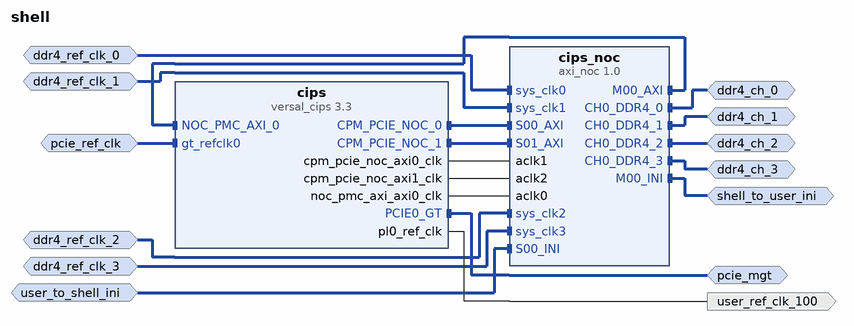
[diagram p0: block diagram of the top level]
# Vivado block design shell, xcvc1902-vsvd1760-2MP-e-S, Vivado 2022.2
create_bd_design shell

create_bd_intf_port -mode Slave -vlnv xilinx.com:interface:diff_clock_rtl:1.0 pcie_ref_clk
create_bd_intf_port -mode Master -vlnv xilinx.com:interface:gt_rtl:1.0 pcie_mgt
create_bd_intf_port -mode Slave -vlnv xilinx.com:interface:diff_clock_rtl:1.0 ddr4_ref_clk_0
set_property -dict {CONFIG.FREQ_HZ 200000000} [get_bd_intf_ports ddr4_ref_clk_0]
create_bd_intf_port -mode Slave -vlnv xilinx.com:interface:diff_clock_rtl:1.0 ddr4_ref_clk_1
set_property -dict {CONFIG.FREQ_HZ 200000000} [get_bd_intf_ports ddr4_ref_clk_1]
create_bd_intf_port -mode Slave -vlnv xilinx.com:interface:diff_clock_rtl:1.0 ddr4_ref_clk_2
set_property -dict {CONFIG.FREQ_HZ 200000000} [get_bd_intf_ports ddr4_ref_clk_2]
create_bd_intf_port -mode Slave -vlnv xilinx.com:interface:diff_clock_rtl:1.0 ddr4_ref_clk_3
set_property -dict {CONFIG.FREQ_HZ 200000000} [get_bd_intf_ports ddr4_ref_clk_3]
create_bd_intf_port -mode Master -vlnv xilinx.com:interface:ddr4_rtl:1.0 ddr4_ch_0
create_bd_intf_port -mode Master -vlnv xilinx.com:interface:ddr4_rtl:1.0 ddr4_ch_1
create_bd_intf_port -mode Master -vlnv xilinx.com:interface:ddr4_rtl:1.0 ddr4_ch_2
create_bd_intf_port -mode Master -vlnv xilinx.com:interface:ddr4_rtl:1.0 ddr4_ch_3
create_bd_intf_port -mode Master -vlnv xilinx.com:interface:inimm_rtl:1.0 shell_to_user_ini
set_property -dict {CONFIG.INI_STRATEGY auto} [get_bd_intf_ports shell_to_user_ini]
create_bd_intf_port -mode Slave -vlnv xilinx.com:interface:inimm_rtl:1.0 user_to_shell_ini
create_bd_port -dir O -type clk user_ref_clk_100

create_bd_cell -type ip -vlnv xilinx.com:ip:versal_cips:3.3 cips
set_property -dict [list \
  CONFIG.BOOT_MODE Custom \
  CONFIG.CLOCK_MODE Custom \
  CONFIG.CPM_CONFIG {['CPM_PCIE0_CFG_EXT_IF 0 CPM_PCIE0_COPY_XDMA_PF0_ENABLED 0 CPM_PCIE0_EXT_PCIE_CFG_SPACE_ENABLED None CPM_PCIE0_MAX_LINK_SPEED 16.0_GT/s CPM_PCIE0_MODES DMA CPM_PCIE0_MODE_SELECTION Advanced', 'CPM_PCIE0_MSI_X_OPTIONS MSI-X_Internal CPM_PCIE0_NUM_USR_IRQ 16 CPM_PCIE0_PF0_BAR0_XDMA_64BIT 1 CPM_PCIE0_PF0_BAR0_XDMA_TYPE DMA CPM_PCIE0_PF0_BAR2_XDMA_64BIT 1 CPM_PCIE0_PF0_BAR2_XDMA_ENABLED 1', 'CPM_PCIE0_PF0_BAR2_XDMA_SCALE Megabytes CPM_PCIE0_PF0_BAR2_XDMA_SIZE 128 CPM_PCIE0_PF0_BASE_CLASS_MENU Processors CPM_PCIE0_PF0_INTERRUPT_PIN INTA CPM_PCIE0_PF0_PCIEBAR2AXIBAR_XDMA_2 0x00101220000', 'CPM_PCIE0_PF0_SUB_CLASS_INTF_MENU Co_processor CPM_PCIE0_PF0_USE_CLASS_CODE_LOOKUP_ASSISTANT 1 CPM_PCIE0_PF1_BAR0_XDMA_64BIT 0 CPM_PCIE0_PF1_BAR0_XDMA_SCALE Kilobytes CPM_PCIE0_PF1_BAR0_XDMA_SIZE 4', 'CPM_PCIE0_PF1_BAR0_XDMA_TYPE AXI_Bridge_Master CPM_PCIE0_PF1_BAR2_XDMA_64BIT 1 CPM_PCIE0_PF1_BAR2_XDMA_ENABLED 1 CPM_PCIE0_PF1_BAR2_XDMA_SCALE Megabytes CPM_PCIE0_PF1_BAR2_XDMA_SIZE 128', 'CPM_PCIE0_PF1_BAR2_XDMA_TYPE AXI_Bridge_Master CPM_PCIE0_PF1_BASE_CLASS_MENU Processors CPM_PCIE0_PF1_INTERRUPT_PIN INTB CPM_PCIE0_PF1_PCIEBAR2AXIBAR_XDMA_2 0x20100000000', 'CPM_PCIE0_PF1_SUB_CLASS_INTF_MENU Co_processor CPM_PCIE0_PF1_USE_CLASS_CODE_LOOKUP_ASSISTANT 1 CPM_PCIE0_PL_LINK_CAP_MAX_LINK_WIDTH X8 CPM_PCIE0_TL_PF_ENABLE_REG 1 CPM_PCIE0_XDMA_RNUM_CHNL 4', 'CPM_PCIE0_XDMA_WNUM_CHNL 4 CPM_PCIE1_MODES None PS_USE_NOC_PS_PCI_0 0']} \
  CONFIG.DDR_MEMORY_MODE Custom \
  CONFIG.DESIGN_MODE 1 \
  CONFIG.DEVICE_INTEGRITY_MODE Custom \
  CONFIG.IO_CONFIG_MODE Custom \
  CONFIG.PS_PMC_CONFIG {['CLOCK_MODE Custom', 'DESIGN_MODE 1', 'DEVICE_INTEGRITY_MODE Custom', 'IO_CONFIG_MODE Custom', 'PCIE_APERTURES_DUAL_ENABLE 0', 'PCIE_APERTURES_SINGLE_ENABLE 1', 'PMC_BANK_1_IO_STANDARD LVCMOS3.3', 'PMC_CRP_HSM0_REF_CTRL_FREQMHZ 33.33333333', 'PMC_CRP_HSM1_REF_CTRL_FREQMHZ 133.3333333', 'PMC_CRP_OSPI_REF_CTRL_FREQMHZ 101', 'PMC_CRP_PL0_REF_CTRL_FREQMHZ 100', 'PMC_I2CPMC_PERIPHERAL {{ENABLE 1} {IO {PMC_MIO 26 .. 27}}}', 'PMC_MIO12 {{AUX_IO 0} {DIRECTION out} {DRIVE_STRENGTH 8mA} {OUTPUT_DATA default} {PULL pullup} {SCHMITT 0} {SLEW slow} {USAGE GPIO}}', 'PMC_MIO39 {{AUX_IO 0} {DIRECTION in} {DRIVE_STRENGTH 4mA} {OUTPUT_DATA default} {PULL disable} {SCHMITT 0} {SLEW slow} {USAGE GPIO}}', 'PMC_MIO40 {{AUX_IO 0} {DIRECTION out} {DRIVE_STRENGTH 8mA} {OUTPUT_DATA default} {PULL pullup} {SCHMITT 0} {SLEW slow} {USAGE GPIO}}', 'PMC_MIO41 {{AUX_IO 0} {DIRECTION in} {DRIVE_STRENGTH 8mA} {OUTPUT_DATA default} {PULL pullup} {SCHMITT 0} {SLEW slow} {USAGE GPIO}}', 'PMC_MIO42 {{AUX_IO 0} {DIRECTION in} {DRIVE_STRENGTH 8mA} {OUTPUT_DATA default} {PULL pullup} {SCHMITT 0} {SLEW slow} {USAGE GPIO}}', 'PMC_MIO43 {{AUX_IO 0} {DIRECTION out} {DRIVE_STRENGTH 8mA} {OUTPUT_DATA default} {PULL pullup} {SCHMITT 0} {SLEW slow} {USAGE GPIO}}', 'PMC_MIO44 {{AUX_IO 0} {DIRECTION out} {DRIVE_STRENGTH 8mA} {OUTPUT_DATA default} {PULL pullup} {SCHMITT 0} {SLEW slow} {USAGE GPIO}}', 'PMC_MIO45 {{AUX_IO 0} {DIRECTION out} {DRIVE_STRENGTH 8mA} {OUTPUT_DATA default} {PULL pullup} {SCHMITT 0} {SLEW slow} {USAGE GPIO}}', 'PMC_MIO46 {{AUX_IO 0} {DIRECTION in} {DRIVE_STRENGTH 8mA} {OUTPUT_DATA default} {PULL pullup} {SCHMITT 0} {SLEW slow} {USAGE GPIO}}', 'PMC_MIO47 {{AUX_IO 0} {DIRECTION in} {DRIVE_STRENGTH 8mA} {OUTPUT_DATA default} {PULL pullup} {SCHMITT 0} {SLEW slow} {USAGE GPIO}}', 'PMC_MIO48 {{AUX_IO 0} {DIRECTION out} {DRIVE_STRENGTH 8mA} {OUTPUT_DATA default} {PULL pullup} {SCHMITT 0} {SLEW slow} {USAGE GPIO}}', 'PMC_MIO49 {{AUX_IO 0} {DIRECTION out} {DRIVE_STRENGTH 8mA} {OUTPUT_DATA default} {PULL pullup} {SCHMITT 0} {SLEW slow} {USAGE GPIO}}', 'PMC_MIO50 {{AUX_IO 0} {DIRECTION out} {DRIVE_STRENGTH 8mA} {OUTPUT_DATA default} {PULL pullup} {SCHMITT 0} {SLEW slow} {USAGE GPIO}}', 'PMC_OSPI_PERIPHERAL {{ENABLE 1} {IO {PMC_MIO 0 .. 11}} {MODE Single}}', 'PMC_REF_CLK_FREQMHZ 33.3333333', 'PMC_USE_NOC_PMC_AXI0 1', 'PS_BANK_2_IO_STANDARD LVCMOS3.3', 'PS_BOARD_INTERFACE Custom', 'PS_GEN_IPI0_ENABLE 1', 'PS_GEN_IPI1_ENABLE 1', 'PS_GEN_IPI2_ENABLE 1', 'PS_GEN_IPI3_ENABLE 1', 'PS_GEN_IPI3_MASTER R5_0', 'PS_GEN_IPI4_ENABLE 1', 'PS_GEN_IPI4_MASTER R5_0', 'PS_GEN_IPI5_ENABLE 1', 'PS_GEN_IPI5_MASTER R5_1', 'PS_GEN_IPI6_ENABLE 1', 'PS_GEN_IPI6_MASTER R5_1', 'PS_I2C0_PERIPHERAL {{ENABLE 1} {IO {PMC_MIO 30 .. 31}}}', 'PS_I2C1_PERIPHERAL {{ENABLE 1} {IO {PS_MIO 24 .. 25}}}', 'PS_I2CSYSMON_PERIPHERAL {{ENABLE 0} {IO {PMC_MIO 18 .. 20}}}', 'PS_IRQ_USAGE {{CH0 0} {CH1 0} {CH10 0} {CH11 0} {CH12 0} {CH13 0} {CH14 0} {CH15 0} {CH2 0} {CH3 0} {CH4 0} {CH5 0} {CH6 0} {CH7 0} {CH8 0} {CH9 0}}', 'PS_MIO5 {{AUX_IO 0} {DIRECTION out} {DRIVE_STRENGTH 8mA} {OUTPUT_DATA high} {PULL pulldown} {SCHMITT 0} {SLEW slow} {USAGE GPIO}}', 'PS_NUM_FABRIC_RESETS 0', 'PS_PCIE1_PERIPHERAL_ENABLE 1', 'PS_PCIE2_PERIPHERAL_ENABLE 0', 'PS_PCIE_EP_RESET1_IO {PMC_MIO 38}', 'PS_PCIE_RESET {{ENABLE 1}}', 'PS_TTC0_PERIPHERAL_ENABLE 1', 'PS_TTC1_PERIPHERAL_ENABLE 1', 'PS_TTC2_PERIPHERAL_ENABLE 1', 'PS_TTC3_PERIPHERAL_ENABLE 1', 'PS_UART0_PERIPHERAL {{ENABLE 1} {IO {PS_MIO 16 .. 17}}}', 'PS_UART1_PERIPHERAL {{ENABLE 1} {IO {PS_MIO 20 .. 21}}}', 'PS_USE_PMCPL_CLK0 1', 'PS_USE_PMCPL_CLK1 0', 'PS_USE_PMCPL_CLK2 0', 'PS_USE_PMCPL_CLK3 0', 'SMON_ALARMS Set_Alarms_On', 'SMON_ENABLE_TEMP_AVERAGING 0', 'SMON_INTERFACE_TO_USE PMBus', 'SMON_MEAS33 {{ALARM_ENABLE 0} {ALARM_LOWER 0.00} {ALARM_UPPER 2.00} {AVERAGE_EN 0} {ENABLE 0} {MODE {2 V unipolar}} {NAME VCCAUX} {SUPPLY_NUM 0}}', 'SMON_MEAS34 {{ALARM_ENABLE 0} {ALARM_LOWER 0.00} {ALARM_UPPER 2.00} {AVERAGE_EN 0} {ENABLE 0} {MODE {2 V unipolar}} {NAME VCCAUX_PMC} {SUPPLY_NUM 0}}', 'SMON_MEAS36 {{ALARM_ENABLE 0} {ALARM_LOWER 0.00} {ALARM_UPPER 2.00} {AVERAGE_EN 0} {ENABLE 1} {MODE {2 V unipolar}} {NAME VCCINT} {SUPPLY_NUM 0}}', 'SMON_MEAS56 {{ALARM_ENABLE 0} {ALARM_LOWER 0.00} {ALARM_UPPER 2.00} {AVERAGE_EN 0} {ENABLE 0} {MODE {2 V unipolar}} {NAME VCC_PMC} {SUPPLY_NUM 0}}', 'SMON_MEAS57 {{ALARM_ENABLE 0} {ALARM_LOWER 0.00} {ALARM_UPPER 2.00} {AVERAGE_EN 0} {ENABLE 0} {MODE {2 V unipolar}} {NAME VCC_PSFP} {SUPPLY_NUM 0}}', 'SMON_MEAS58 {{ALARM_ENABLE 0} {ALARM_LOWER 0.00} {ALARM_UPPER 2.00} {AVERAGE_EN 0} {ENABLE 0} {MODE {2 V unipolar}} {NAME VCC_PSLP} {SUPPLY_NUM 0}}', 'SMON_MEAS60 {{ALARM_ENABLE 0} {ALARM_LOWER 0.00} {ALARM_UPPER 2.00} {AVERAGE_EN 0} {ENABLE 0} {MODE {2 V unipolar}} {NAME VCC_SOC} {SUPPLY_NUM 0}}', 'SMON_MEAS61 {{ALARM_ENABLE 0} {ALARM_LOWER 0.00} {ALARM_UPPER 2.00} {AVERAGE_EN 0} {ENABLE 0} {MODE {2 V unipolar}} {NAME VP_VN} {SUPPLY_NUM 0}}', 'SMON_PMBUS_ADDRESS 0x30', 'SMON_PMBUS_UNRESTRICTED 1', 'SMON_TEMP_AVERAGING_SAMPLES 0', 'SMON_VOLTAGE_AVERAGING_SAMPLES 8']} \
] [get_bd_cells cips]
create_bd_cell -type ip -vlnv xilinx.com:ip:axi_noc:1.0 cips_noc
set_property -dict [list \
  CONFIG.MC_CHAN_REGION0 NONE \
  CONFIG.MC_CHAN_REGION1 DDR_LOW3 \
  CONFIG.MC_COMPONENT_WIDTH x16 \
  CONFIG.MC_DATAWIDTH 72 \
  CONFIG.MC_EN_BACKGROUND_SCRUBBING false \
  CONFIG.MC_INPUTCLK0_PERIOD 5000 \
  CONFIG.MC_INTERLEAVE_SIZE 4096 \
  CONFIG.MC_MEMORY_SPEEDGRADE {DDR4-3200AA(22-22-22)} \
  CONFIG.NUM_CLKS 3 \
  CONFIG.NUM_MC 4 \
  CONFIG.NUM_MI 1 \
  CONFIG.NUM_NMI 1 \
  CONFIG.NUM_NSI 1 \
  CONFIG.NUM_SI 2 \
] [get_bd_cells cips_noc]

# ---- connections ----

connect_bd_intf_net -intf_net axi_noc_0_M00_AXI [get_bd_intf_pins cips_noc/M00_AXI] [get_bd_intf_pins cips/NOC_PMC_AXI_0]
connect_bd_intf_net [get_bd_intf_pins cips_noc/S00_AXI] [get_bd_intf_pins cips/CPM_PCIE_NOC_0]
connect_bd_intf_net [get_bd_intf_pins cips_noc/S01_AXI] [get_bd_intf_pins cips/CPM_PCIE_NOC_1]
connect_bd_intf_net [get_bd_intf_ports pcie_mgt] [get_bd_intf_pins cips/PCIE0_GT]
connect_bd_intf_net [get_bd_intf_ports ddr4_ch_0] [get_bd_intf_pins cips_noc/CH0_DDR4_0]
connect_bd_intf_net [get_bd_intf_ports ddr4_ch_1] [get_bd_intf_pins cips_noc/CH0_DDR4_1]
connect_bd_intf_net [get_bd_intf_ports ddr4_ch_2] [get_bd_intf_pins cips_noc/CH0_DDR4_2]
connect_bd_intf_net [get_bd_intf_ports ddr4_ch_3] [get_bd_intf_pins cips_noc/CH0_DDR4_3]
connect_bd_intf_net [get_bd_intf_ports ddr4_ref_clk_0] [get_bd_intf_pins cips_noc/sys_clk0]
connect_bd_intf_net [get_bd_intf_ports ddr4_ref_clk_1] [get_bd_intf_pins cips_noc/sys_clk1]
connect_bd_intf_net [get_bd_intf_ports ddr4_ref_clk_2] [get_bd_intf_pins cips_noc/sys_clk2]
connect_bd_intf_net [get_bd_intf_ports ddr4_ref_clk_3] [get_bd_intf_pins cips_noc/sys_clk3]
connect_bd_intf_net -intf_net gt_refclk0_0_1 [get_bd_intf_ports pcie_ref_clk] [get_bd_intf_pins cips/gt_refclk0]
connect_bd_intf_net [get_bd_intf_ports shell_to_user_ini] [get_bd_intf_pins cips_noc/M00_INI]
connect_bd_intf_net [get_bd_intf_ports user_to_shell_ini] [get_bd_intf_pins cips_noc/S00_INI]
connect_bd_net [get_bd_pins cips/cpm_pcie_noc_axi0_clk] [get_bd_pins cips_noc/aclk1]
connect_bd_net [get_bd_pins cips/cpm_pcie_noc_axi1_clk] [get_bd_pins cips_noc/aclk2]
connect_bd_net [get_bd_pins cips/noc_pmc_axi_axi0_clk] [get_bd_pins cips_noc/aclk0]
connect_bd_net -net user_ref_clk_100 [get_bd_pins cips/pl0_ref_clk] [get_bd_ports user_ref_clk_100]

# ---- address map ----
assign_bd_address -offset 0x00000000C0000000 -range 512M -target_address_space [get_bd_addr_spaces cips/CPM_PCIE_NOC_0] [get_bd_addr_segs cips/NOC_PMC_AXI_0/pspmc_0_psv_pmc_qspi_ospi_flash_0]
assign_bd_address -offset 0x00000000FC000000 -range 16M -target_address_space [get_bd_addr_spaces cips/CPM_PCIE_NOC_0] [get_bd_addr_segs cips/NOC_PMC_AXI_0/pspmc_0_psv_cpm]
assign_bd_address -offset 0x00000000FF000000 -range 64K -target_address_space [get_bd_addr_spaces cips/CPM_PCIE_NOC_0] [get_bd_addr_segs cips/NOC_PMC_AXI_0/pspmc_0_psv_sbsauart_0]
assign_bd_address -offset 0x00000000FF010000 -range 64K -target_address_space [get_bd_addr_spaces cips/CPM_PCIE_NOC_0] [get_bd_addr_segs cips/NOC_PMC_AXI_0/pspmc_0_psv_sbsauart_1]
assign_bd_address -offset 0x00000000FF020000 -range 64K -target_address_space [get_bd_addr_spaces cips/CPM_PCIE_NOC_0] [get_bd_addr_segs cips/NOC_PMC_AXI_0/pspmc_0_psv_i2c_0]
assign_bd_address -offset 0x00000000FF030000 -range 64K -target_address_space [get_bd_addr_spaces cips/CPM_PCIE_NOC_0] [get_bd_addr_segs cips/NOC_PMC_AXI_0/pspmc_0_psv_i2c_1]
assign_bd_address -offset 0x00000000FF080000 -range 128K -target_address_space [get_bd_addr_spaces cips/CPM_PCIE_NOC_0] [get_bd_addr_segs cips/NOC_PMC_AXI_0/pspmc_0_psv_lpd_iou_slcr_0]
assign_bd_address -offset 0x00000000FF0A0000 -range 64K -target_address_space [get_bd_addr_spaces cips/CPM_PCIE_NOC_0] [get_bd_addr_segs cips/NOC_PMC_AXI_0/pspmc_0_psv_lpd_iou_secure_slcr_0]
assign_bd_address -offset 0x00000000FF0B0000 -range 64K -target_address_space [get_bd_addr_spaces cips/CPM_PCIE_NOC_0] [get_bd_addr_segs cips/NOC_PMC_AXI_0/pspmc_0_psv_gpio_2]
assign_bd_address -offset 0x00000000FF0E0000 -range 64K -target_address_space [get_bd_addr_spaces cips/CPM_PCIE_NOC_0] [get_bd_addr_segs cips/NOC_PMC_AXI_0/pspmc_0_psv_ttc_0]
assign_bd_address -offset 0x00000000FF0F0000 -range 64K -target_address_space [get_bd_addr_spaces cips/CPM_PCIE_NOC_0] [get_bd_addr_segs cips/NOC_PMC_AXI_0/pspmc_0_psv_ttc_1]
assign_bd_address -offset 0x00000000FF100000 -range 64K -target_address_space [get_bd_addr_spaces cips/CPM_PCIE_NOC_0] [get_bd_addr_segs cips/NOC_PMC_AXI_0/pspmc_0_psv_ttc_2]
assign_bd_address -offset 0x00000000FF110000 -range 64K -target_address_space [get_bd_addr_spaces cips/CPM_PCIE_NOC_0] [get_bd_addr_segs cips/NOC_PMC_AXI_0/pspmc_0_psv_ttc_3]
assign_bd_address -offset 0x00000000FF130000 -range 64K -target_address_space [get_bd_addr_spaces cips/CPM_PCIE_NOC_0] [get_bd_addr_segs cips/NOC_PMC_AXI_0/pspmc_0_psv_scntr_0]
assign_bd_address -offset 0x00000000FF140000 -range 64K -target_address_space [get_bd_addr_spaces cips/CPM_PCIE_NOC_0] [get_bd_addr_segs cips/NOC_PMC_AXI_0/pspmc_0_psv_scntrs_0]
assign_bd_address -offset 0x00000000FF310000 -range 64K -target_address_space [get_bd_addr_spaces cips/CPM_PCIE_NOC_0] [get_bd_addr_segs cips/NOC_PMC_AXI_0/pspmc_0_psv_ipi_psm]
assign_bd_address -offset 0x00000000FF320000 -range 64K -target_address_space [get_bd_addr_spaces cips/CPM_PCIE_NOC_0] [get_bd_addr_segs cips/NOC_PMC_AXI_0/pspmc_0_psv_ipi_pmc]
assign_bd_address -offset 0x00000000FF330000 -range 64K -target_address_space [get_bd_addr_spaces cips/CPM_PCIE_NOC_0] [get_bd_addr_segs cips/NOC_PMC_AXI_0/pspmc_0_psv_ipi_0]
assign_bd_address -offset 0x00000000FF340000 -range 64K -target_address_space [get_bd_addr_spaces cips/CPM_PCIE_NOC_0] [get_bd_addr_segs cips/NOC_PMC_AXI_0/pspmc_0_psv_ipi_1]
assign_bd_address -offset 0x00000000FF350000 -range 64K -target_address_space [get_bd_addr_spaces cips/CPM_PCIE_NOC_0] [get_bd_addr_segs cips/NOC_PMC_AXI_0/pspmc_0_psv_ipi_2]
assign_bd_address -offset 0x00000000FF360000 -range 64K -target_address_space [get_bd_addr_spaces cips/CPM_PCIE_NOC_0] [get_bd_addr_segs cips/NOC_PMC_AXI_0/pspmc_0_psv_ipi_3]
assign_bd_address -offset 0x00000000FF370000 -range 64K -target_address_space [get_bd_addr_spaces cips/CPM_PCIE_NOC_0] [get_bd_addr_segs cips/NOC_PMC_AXI_0/pspmc_0_psv_ipi_4]
assign_bd_address -offset 0x00000000FF380000 -range 64K -target_address_space [get_bd_addr_spaces cips/CPM_PCIE_NOC_0] [get_bd_addr_segs cips/NOC_PMC_AXI_0/pspmc_0_psv_ipi_5]
assign_bd_address -offset 0x00000000FF390000 -range 64K -target_address_space [get_bd_addr_spaces cips/CPM_PCIE_NOC_0] [get_bd_addr_segs cips/NOC_PMC_AXI_0/pspmc_0_psv_ipi_pmc_nobuf]
assign_bd_address -offset 0x00000000FF3A0000 -range 64K -target_address_space [get_bd_addr_spaces cips/CPM_PCIE_NOC_0] [get_bd_addr_segs cips/NOC_PMC_AXI_0/pspmc_0_psv_ipi_6]
assign_bd_address -offset 0x00000000FF410000 -range 1M -target_address_space [get_bd_addr_spaces cips/CPM_PCIE_NOC_0] [get_bd_addr_segs cips/NOC_PMC_AXI_0/pspmc_0_psv_lpd_slcr_0]
assign_bd_address -offset 0x00000000FF510000 -range 256K -target_address_space [get_bd_addr_spaces cips/CPM_PCIE_NOC_0] [get_bd_addr_segs cips/NOC_PMC_AXI_0/pspmc_0_psv_lpd_slcr_secure_0]
assign_bd_address -offset 0x00000000FF5E0000 -range 3M -target_address_space [get_bd_addr_spaces cips/CPM_PCIE_NOC_0] [get_bd_addr_segs cips/NOC_PMC_AXI_0/pspmc_0_psv_crl_0]
assign_bd_address -offset 0x00000000FF960000 -range 64K -target_address_space [get_bd_addr_spaces cips/CPM_PCIE_NOC_0] [get_bd_addr_segs cips/NOC_PMC_AXI_0/pspmc_0_psv_ocm_ctrl]
assign_bd_address -offset 0x00000000FF980000 -range 64K -target_address_space [get_bd_addr_spaces cips/CPM_PCIE_NOC_0] [get_bd_addr_segs cips/NOC_PMC_AXI_0/pspmc_0_psv_ocm_xmpu_0]
assign_bd_address -offset 0x00000000FF990000 -range 64K -target_address_space [get_bd_addr_spaces cips/CPM_PCIE_NOC_0] [get_bd_addr_segs cips/NOC_PMC_AXI_0/pspmc_0_psv_lpd_xppu_0]
assign_bd_address -offset 0x00000000FF9A0000 -range 64K -target_address_space [get_bd_addr_spaces cips/CPM_PCIE_NOC_0] [get_bd_addr_segs cips/NOC_PMC_AXI_0/pspmc_0_psv_rpu_0]
assign_bd_address -offset 0x00000000FF9B0000 -range 64K -target_address_space [get_bd_addr_spaces cips/CPM_PCIE_NOC_0] [get_bd_addr_segs cips/NOC_PMC_AXI_0/pspmc_0_psv_lpd_afi_0]
assign_bd_address -offset 0x00000000FFA80000 -range 64K -target_address_space [get_bd_addr_spaces cips/CPM_PCIE_NOC_0] [get_bd_addr_segs cips/NOC_PMC_AXI_0/pspmc_0_psv_adma_0]
assign_bd_address -offset 0x00000000FFA90000 -range 64K -target_address_space [get_bd_addr_spaces cips/CPM_PCIE_NOC_0] [get_bd_addr_segs cips/NOC_PMC_AXI_0/pspmc_0_psv_adma_1]
assign_bd_address -offset 0x00000000FFAA0000 -range 64K -target_address_space [get_bd_addr_spaces cips/CPM_PCIE_NOC_0] [get_bd_addr_segs cips/NOC_PMC_AXI_0/pspmc_0_psv_adma_2]
assign_bd_address -offset 0x00000000FFAB0000 -range 64K -target_address_space [get_bd_addr_spaces cips/CPM_PCIE_NOC_0] [get_bd_addr_segs cips/NOC_PMC_AXI_0/pspmc_0_psv_adma_3]
assign_bd_address -offset 0x00000000FFAC0000 -range 64K -target_address_space [get_bd_addr_spaces cips/CPM_PCIE_NOC_0] [get_bd_addr_segs cips/NOC_PMC_AXI_0/pspmc_0_psv_adma_4]
assign_bd_address -offset 0x00000000FFAD0000 -range 64K -target_address_space [get_bd_addr_spaces cips/CPM_PCIE_NOC_0] [get_bd_addr_segs cips/NOC_PMC_AXI_0/pspmc_0_psv_adma_5]
assign_bd_address -offset 0x00000000FFAE0000 -range 64K -target_address_space [get_bd_addr_spaces cips/CPM_PCIE_NOC_0] [get_bd_addr_segs cips/NOC_PMC_AXI_0/pspmc_0_psv_adma_6]
assign_bd_address -offset 0x00000000FFAF0000 -range 64K -target_address_space [get_bd_addr_spaces cips/CPM_PCIE_NOC_0] [get_bd_addr_segs cips/NOC_PMC_AXI_0/pspmc_0_psv_adma_7]
assign_bd_address -offset 0x00000000FFC90000 -range 60K -target_address_space [get_bd_addr_spaces cips/CPM_PCIE_NOC_0] [get_bd_addr_segs cips/NOC_PMC_AXI_0/pspmc_0_psv_psm_global_reg]
assign_bd_address -offset 0x00000000FFE00000 -range 256K -target_address_space [get_bd_addr_spaces cips/CPM_PCIE_NOC_0] [get_bd_addr_segs cips/NOC_PMC_AXI_0/pspmc_0_psv_r5_tcm_ram_global]
assign_bd_address -offset 0x00000000FFE90000 -range 64K -target_address_space [get_bd_addr_spaces cips/CPM_PCIE_NOC_0] [get_bd_addr_segs cips/NOC_PMC_AXI_0/pspmc_0_psv_r5_1_atcm_global]
assign_bd_address -offset 0x00000000FFEB0000 -range 64K -target_address_space [get_bd_addr_spaces cips/CPM_PCIE_NOC_0] [get_bd_addr_segs cips/NOC_PMC_AXI_0/pspmc_0_psv_r5_1_btcm_global]
assign_bd_address -offset 0x00000000FFFC0000 -range 256K -target_address_space [get_bd_addr_spaces cips/CPM_PCIE_NOC_0] [get_bd_addr_segs cips/NOC_PMC_AXI_0/pspmc_0_psv_ocm_ram_0]
assign_bd_address -offset 0x0000000100083000 -range 4K -target_address_space [get_bd_addr_spaces cips/CPM_PCIE_NOC_0] [get_bd_addr_segs cips/NOC_PMC_AXI_0/pspmc_0_psv_pmc_tmr_inject_0]
assign_bd_address -offset 0x0000000100200000 -range 256K -target_address_space [get_bd_addr_spaces cips/CPM_PCIE_NOC_0] [get_bd_addr_segs cips/NOC_PMC_AXI_0/pspmc_0_psv_pmc_ram_instr_cntlr]
assign_bd_address -offset 0x0000000100240000 -range 128K -target_address_space [get_bd_addr_spaces cips/CPM_PCIE_NOC_0] [get_bd_addr_segs cips/NOC_PMC_AXI_0/pspmc_0_psv_pmc_ram_data_cntlr]
assign_bd_address -offset 0x0000000100280000 -range 4K -target_address_space [get_bd_addr_spaces cips/CPM_PCIE_NOC_0] [get_bd_addr_segs cips/NOC_PMC_AXI_0/pspmc_0_psv_pmc_iomodule_0]
assign_bd_address -offset 0x0000000100283000 -range 4K -target_address_space [get_bd_addr_spaces cips/CPM_PCIE_NOC_0] [get_bd_addr_segs cips/NOC_PMC_AXI_0/pspmc_0_psv_pmc_tmr_manager_0]
assign_bd_address -offset 0x0000000100310000 -range 32K -target_address_space [get_bd_addr_spaces cips/CPM_PCIE_NOC_0] [get_bd_addr_segs cips/NOC_PMC_AXI_0/pspmc_0_psv_pmc_ppu1_mdm_0]
assign_bd_address -offset 0x0000000100800000 -range 64K -target_address_space [get_bd_addr_spaces cips/CPM_PCIE_NOC_0] [get_bd_addr_segs cips/NOC_PMC_AXI_0/pspmc_0_psv_coresight_0]
assign_bd_address -offset 0x0000000100980000 -range 64K -target_address_space [get_bd_addr_spaces cips/CPM_PCIE_NOC_0] [get_bd_addr_segs cips/NOC_PMC_AXI_0/pspmc_0_psv_coresight_lpd_atm]
assign_bd_address -offset 0x0000000100B70000 -range 64K -target_address_space [get_bd_addr_spaces cips/CPM_PCIE_NOC_0] [get_bd_addr_segs cips/NOC_PMC_AXI_0/pspmc_0_psv_coresight_fpd_stm]
assign_bd_address -offset 0x0000000100B80000 -range 64K -target_address_space [get_bd_addr_spaces cips/CPM_PCIE_NOC_0] [get_bd_addr_segs cips/NOC_PMC_AXI_0/pspmc_0_psv_coresight_fpd_atm]
assign_bd_address -offset 0x0000000100C20000 -range 64K -target_address_space [get_bd_addr_spaces cips/CPM_PCIE_NOC_0] [get_bd_addr_segs cips/NOC_PMC_AXI_0/pspmc_0_psv_coresight_apu_fun]
assign_bd_address -offset 0x0000000100C30000 -range 64K -target_address_space [get_bd_addr_spaces cips/CPM_PCIE_NOC_0] [get_bd_addr_segs cips/NOC_PMC_AXI_0/pspmc_0_psv_coresight_apu_etf]
assign_bd_address -offset 0x0000000100C60000 -range 64K -target_address_space [get_bd_addr_spaces cips/CPM_PCIE_NOC_0] [get_bd_addr_segs cips/NOC_PMC_AXI_0/pspmc_0_psv_coresight_apu_ela]
assign_bd_address -offset 0x0000000100CA0000 -range 64K -target_address_space [get_bd_addr_spaces cips/CPM_PCIE_NOC_0] [get_bd_addr_segs cips/NOC_PMC_AXI_0/pspmc_0_psv_coresight_apu_cti]
assign_bd_address -offset 0x0000000100D00000 -range 64K -target_address_space [get_bd_addr_spaces cips/CPM_PCIE_NOC_0] [get_bd_addr_segs cips/NOC_PMC_AXI_0/pspmc_0_psv_coresight_a720_dbg]
assign_bd_address -offset 0x0000000100D10000 -range 64K -target_address_space [get_bd_addr_spaces cips/CPM_PCIE_NOC_0] [get_bd_addr_segs cips/NOC_PMC_AXI_0/pspmc_0_psv_coresight_a720_cti]
assign_bd_address -offset 0x0000000100D20000 -range 64K -target_address_space [get_bd_addr_spaces cips/CPM_PCIE_NOC_0] [get_bd_addr_segs cips/NOC_PMC_AXI_0/pspmc_0_psv_coresight_a720_pmu]
assign_bd_address -offset 0x0000000100D30000 -range 64K -target_address_space [get_bd_addr_spaces cips/CPM_PCIE_NOC_0] [get_bd_addr_segs cips/NOC_PMC_AXI_0/pspmc_0_psv_coresight_a720_etm]
assign_bd_address -offset 0x0000000100D40000 -range 64K -target_address_space [get_bd_addr_spaces cips/CPM_PCIE_NOC_0] [get_bd_addr_segs cips/NOC_PMC_AXI_0/pspmc_0_psv_coresight_a721_dbg]
assign_bd_address -offset 0x0000000100D50000 -range 64K -target_address_space [get_bd_addr_spaces cips/CPM_PCIE_NOC_0] [get_bd_addr_segs cips/NOC_PMC_AXI_0/pspmc_0_psv_coresight_a721_cti]
assign_bd_address -offset 0x0000000100D60000 -range 64K -target_address_space [get_bd_addr_spaces cips/CPM_PCIE_NOC_0] [get_bd_addr_segs cips/NOC_PMC_AXI_0/pspmc_0_psv_coresight_a721_pmu]
assign_bd_address -offset 0x0000000100D70000 -range 64K -target_address_space [get_bd_addr_spaces cips/CPM_PCIE_NOC_0] [get_bd_addr_segs cips/NOC_PMC_AXI_0/pspmc_0_psv_coresight_a721_etm]
assign_bd_address -offset 0x0000000100F00000 -range 64K -target_address_space [get_bd_addr_spaces cips/CPM_PCIE_NOC_0] [get_bd_addr_segs cips/NOC_PMC_AXI_0/pspmc_0_psv_coresight_cpm_rom]
assign_bd_address -offset 0x0000000100F20000 -range 64K -target_address_space [get_bd_addr_spaces cips/CPM_PCIE_NOC_0] [get_bd_addr_segs cips/NOC_PMC_AXI_0/pspmc_0_psv_coresight_cpm_fun]
assign_bd_address -offset 0x0000000100F40000 -range 64K -target_address_space [get_bd_addr_spaces cips/CPM_PCIE_NOC_0] [get_bd_addr_segs cips/NOC_PMC_AXI_0/pspmc_0_psv_coresight_cpm_ela2a]
assign_bd_address -offset 0x0000000100F50000 -range 64K -target_address_space [get_bd_addr_spaces cips/CPM_PCIE_NOC_0] [get_bd_addr_segs cips/NOC_PMC_AXI_0/pspmc_0_psv_coresight_cpm_ela2b]
assign_bd_address -offset 0x0000000100F60000 -range 64K -target_address_space [get_bd_addr_spaces cips/CPM_PCIE_NOC_0] [get_bd_addr_segs cips/NOC_PMC_AXI_0/pspmc_0_psv_coresight_cpm_ela2c]
assign_bd_address -offset 0x0000000100F70000 -range 64K -target_address_space [get_bd_addr_spaces cips/CPM_PCIE_NOC_0] [get_bd_addr_segs cips/NOC_PMC_AXI_0/pspmc_0_psv_coresight_cpm_ela2d]
assign_bd_address -offset 0x0000000100F80000 -range 64K -target_address_space [get_bd_addr_spaces cips/CPM_PCIE_NOC_0] [get_bd_addr_segs cips/NOC_PMC_AXI_0/pspmc_0_psv_coresight_cpm_atm]
assign_bd_address -offset 0x0000000100FA0000 -range 64K -target_address_space [get_bd_addr_spaces cips/CPM_PCIE_NOC_0] [get_bd_addr_segs cips/NOC_PMC_AXI_0/pspmc_0_psv_coresight_cpm_cti2a]
assign_bd_address -offset 0x0000000100FD0000 -range 64K -target_address_space [get_bd_addr_spaces cips/CPM_PCIE_NOC_0] [get_bd_addr_segs cips/NOC_PMC_AXI_0/pspmc_0_psv_coresight_cpm_cti2d]
assign_bd_address -offset 0x0000000101000000 -range 64K -target_address_space [get_bd_addr_spaces cips/CPM_PCIE_NOC_0] [get_bd_addr_segs cips/NOC_PMC_AXI_0/pspmc_0_psv_pmc_i2c_0]
assign_bd_address -offset 0x0000000101010000 -range 64K -target_address_space [get_bd_addr_spaces cips/CPM_PCIE_NOC_0] [get_bd_addr_segs cips/NOC_PMC_AXI_0/pspmc_0_psv_pmc_ospi_0]
assign_bd_address -offset 0x0000000101020000 -range 64K -target_address_space [get_bd_addr_spaces cips/CPM_PCIE_NOC_0] [get_bd_addr_segs cips/NOC_PMC_AXI_0/pspmc_0_psv_pmc_gpio_0]
assign_bd_address -offset 0x0000000101110000 -range 320K -target_address_space [get_bd_addr_spaces cips/CPM_PCIE_NOC_0] [get_bd_addr_segs cips/NOC_PMC_AXI_0/pspmc_0_psv_pmc_global_0]
assign_bd_address -offset 0x00000001011C0000 -range 64K -target_address_space [get_bd_addr_spaces cips/CPM_PCIE_NOC_0] [get_bd_addr_segs cips/NOC_PMC_AXI_0/pspmc_0_psv_pmc_dma_0]
assign_bd_address -offset 0x00000001011D0000 -range 64K -target_address_space [get_bd_addr_spaces cips/CPM_PCIE_NOC_0] [get_bd_addr_segs cips/NOC_PMC_AXI_0/pspmc_0_psv_pmc_dma_1]
assign_bd_address -offset 0x00000001011E0000 -range 64K -target_address_space [get_bd_addr_spaces cips/CPM_PCIE_NOC_0] [get_bd_addr_segs cips/NOC_PMC_AXI_0/pspmc_0_psv_pmc_aes]
assign_bd_address -offset 0x00000001011F0000 -range 64K -target_address_space [get_bd_addr_spaces cips/CPM_PCIE_NOC_0] [get_bd_addr_segs cips/NOC_PMC_AXI_0/pspmc_0_psv_pmc_bbram_ctrl]
assign_bd_address -offset 0x0000000101200000 -range 64K -target_address_space [get_bd_addr_spaces cips/CPM_PCIE_NOC_0] [get_bd_addr_segs cips/NOC_PMC_AXI_0/pspmc_0_psv_pmc_rsa]
assign_bd_address -offset 0x0000000101210000 -range 64K -target_address_space [get_bd_addr_spaces cips/CPM_PCIE_NOC_0] [get_bd_addr_segs cips/NOC_PMC_AXI_0/pspmc_0_psv_pmc_sha]
assign_bd_address -offset 0x0000000101220000 -range 64K -target_address_space [get_bd_addr_spaces cips/CPM_PCIE_NOC_0] [get_bd_addr_segs cips/NOC_PMC_AXI_0/pspmc_0_psv_pmc_slave_boot]
assign_bd_address -offset 0x0000000101230000 -range 64K -target_address_space [get_bd_addr_spaces cips/CPM_PCIE_NOC_0] [get_bd_addr_segs cips/NOC_PMC_AXI_0/pspmc_0_psv_pmc_trng]
assign_bd_address -offset 0x0000000101240000 -range 64K -target_address_space [get_bd_addr_spaces cips/CPM_PCIE_NOC_0] [get_bd_addr_segs cips/NOC_PMC_AXI_0/pspmc_0_psv_pmc_efuse_ctrl]
assign_bd_address -offset 0x0000000101250000 -range 64K -target_address_space [get_bd_addr_spaces cips/CPM_PCIE_NOC_0] [get_bd_addr_segs cips/NOC_PMC_AXI_0/pspmc_0_psv_pmc_efuse_cache]
assign_bd_address -offset 0x0000000101260000 -range 64K -target_address_space [get_bd_addr_spaces cips/CPM_PCIE_NOC_0] [get_bd_addr_segs cips/NOC_PMC_AXI_0/pspmc_0_psv_crp_0]
assign_bd_address -offset 0x0000000101270000 -range 192K -target_address_space [get_bd_addr_spaces cips/CPM_PCIE_NOC_0] [get_bd_addr_segs cips/NOC_PMC_AXI_0/pspmc_0_psv_pmc_sysmon_0]
assign_bd_address -offset 0x00000001012A0000 -range 64K -target_address_space [get_bd_addr_spaces cips/CPM_PCIE_NOC_0] [get_bd_addr_segs cips/NOC_PMC_AXI_0/pspmc_0_psv_pmc_rtc_0]
assign_bd_address -offset 0x00000001012B0000 -range 64K -target_address_space [get_bd_addr_spaces cips/CPM_PCIE_NOC_0] [get_bd_addr_segs cips/NOC_PMC_AXI_0/pspmc_0_psv_pmc_cfu_apb_0]
assign_bd_address -offset 0x00000001012D0000 -range 4K -target_address_space [get_bd_addr_spaces cips/CPM_PCIE_NOC_0] [get_bd_addr_segs cips/NOC_PMC_AXI_0/pspmc_0_psv_pmc_cfi_cframe_0]
assign_bd_address -offset 0x00000001012F0000 -range 64K -target_address_space [get_bd_addr_spaces cips/CPM_PCIE_NOC_0] [get_bd_addr_segs cips/NOC_PMC_AXI_0/pspmc_0_psv_pmc_xmpu_0]
assign_bd_address -offset 0x0000000101300000 -range 64K -target_address_space [get_bd_addr_spaces cips/CPM_PCIE_NOC_0] [get_bd_addr_segs cips/NOC_PMC_AXI_0/pspmc_0_psv_pmc_xppu_npi_0]
assign_bd_address -offset 0x0000000101310000 -range 64K -target_address_space [get_bd_addr_spaces cips/CPM_PCIE_NOC_0] [get_bd_addr_segs cips/NOC_PMC_AXI_0/pspmc_0_psv_pmc_xppu_0]
assign_bd_address -offset 0x0000000102000000 -range 128K -target_address_space [get_bd_addr_spaces cips/CPM_PCIE_NOC_0] [get_bd_addr_segs cips/NOC_PMC_AXI_0/pspmc_0_psv_pmc_ram]
assign_bd_address -offset 0x0000000102100000 -range 64K -target_address_space [get_bd_addr_spaces cips/CPM_PCIE_NOC_0] [get_bd_addr_segs cips/NOC_PMC_AXI_0/pspmc_0_psv_pmc_slave_boot_stream]
assign_bd_address -offset 0x0000000106000000 -range 32M -target_address_space [get_bd_addr_spaces cips/CPM_PCIE_NOC_0] [get_bd_addr_segs cips/NOC_PMC_AXI_0/pspmc_0_psv_pmc_ram_npi]
assign_bd_address -offset 0x0000010000000000 -range 16G -target_address_space [get_bd_addr_spaces cips/CPM_PCIE_NOC_0] [get_bd_addr_segs cips_noc/S00_AXI/C0_DDR_LOW3x4]
assign_bd_address -offset 0x0000020100000000 -range 1T -target_address_space [get_bd_addr_spaces cips/CPM_PCIE_NOC_0] [get_bd_addr_segs shell_to_user_ini/Reg]
exclude_bd_addr_seg -offset 0x0000000000000000 -range 1 -target_address_space [get_bd_addr_spaces cips/CPM_PCIE_NOC_0] [get_bd_addr_segs cips/NOC_PMC_AXI_0/pspmc_0_psv_apu_0]
exclude_bd_addr_seg -offset 0x0000000000000000 -range 1 -target_address_space [get_bd_addr_spaces cips/CPM_PCIE_NOC_0] [get_bd_addr_segs cips/NOC_PMC_AXI_0/pspmc_0_psv_crf_0]
exclude_bd_addr_seg -offset 0x0000000000000000 -range 1 -target_address_space [get_bd_addr_spaces cips/CPM_PCIE_NOC_0] [get_bd_addr_segs cips/NOC_PMC_AXI_0/pspmc_0_psv_fpd_afi_0]
exclude_bd_addr_seg -offset 0x0000000000000000 -range 1 -target_address_space [get_bd_addr_spaces cips/CPM_PCIE_NOC_0] [get_bd_addr_segs cips/NOC_PMC_AXI_0/pspmc_0_psv_fpd_afi_2]
exclude_bd_addr_seg -offset 0x0000000000000000 -range 1 -target_address_space [get_bd_addr_spaces cips/CPM_PCIE_NOC_0] [get_bd_addr_segs cips/NOC_PMC_AXI_0/pspmc_0_psv_fpd_cci_0]
exclude_bd_addr_seg -offset 0x0000000000000000 -range 1 -target_address_space [get_bd_addr_spaces cips/CPM_PCIE_NOC_0] [get_bd_addr_segs cips/NOC_PMC_AXI_0/pspmc_0_psv_fpd_gpv_0]
exclude_bd_addr_seg -offset 0x0000000000000000 -range 1 -target_address_space [get_bd_addr_spaces cips/CPM_PCIE_NOC_0] [get_bd_addr_segs cips/NOC_PMC_AXI_0/pspmc_0_psv_fpd_maincci_0]
exclude_bd_addr_seg -offset 0x0000000000000000 -range 1 -target_address_space [get_bd_addr_spaces cips/CPM_PCIE_NOC_0] [get_bd_addr_segs cips/NOC_PMC_AXI_0/pspmc_0_psv_fpd_slave_xmpu_0]
exclude_bd_addr_seg -offset 0x0000000000000000 -range 1 -target_address_space [get_bd_addr_spaces cips/CPM_PCIE_NOC_0] [get_bd_addr_segs cips/NOC_PMC_AXI_0/pspmc_0_psv_fpd_slcr_0]
exclude_bd_addr_seg -offset 0x0000000000000000 -range 1 -target_address_space [get_bd_addr_spaces cips/CPM_PCIE_NOC_0] [get_bd_addr_segs cips/NOC_PMC_AXI_0/pspmc_0_psv_fpd_slcr_secure_0]
exclude_bd_addr_seg -offset 0x0000000000000000 -range 1 -target_address_space [get_bd_addr_spaces cips/CPM_PCIE_NOC_0] [get_bd_addr_segs cips/NOC_PMC_AXI_0/pspmc_0_psv_fpd_smmu_0]
exclude_bd_addr_seg -offset 0x0000000000000000 -range 1 -target_address_space [get_bd_addr_spaces cips/CPM_PCIE_NOC_0] [get_bd_addr_segs cips/NOC_PMC_AXI_0/pspmc_0_psv_fpd_smmutcu_0]
assign_bd_address -offset 0x00000000C0000000 -range 512M -target_address_space [get_bd_addr_spaces cips/CPM_PCIE_NOC_1] [get_bd_addr_segs cips/NOC_PMC_AXI_0/pspmc_0_psv_pmc_qspi_ospi_flash_0]
assign_bd_address -offset 0x00000000FC000000 -range 16M -target_address_space [get_bd_addr_spaces cips/CPM_PCIE_NOC_1] [get_bd_addr_segs cips/NOC_PMC_AXI_0/pspmc_0_psv_cpm]
assign_bd_address -offset 0x00000000FF000000 -range 64K -target_address_space [get_bd_addr_spaces cips/CPM_PCIE_NOC_1] [get_bd_addr_segs cips/NOC_PMC_AXI_0/pspmc_0_psv_sbsauart_0]
assign_bd_address -offset 0x00000000FF010000 -range 64K -target_address_space [get_bd_addr_spaces cips/CPM_PCIE_NOC_1] [get_bd_addr_segs cips/NOC_PMC_AXI_0/pspmc_0_psv_sbsauart_1]
assign_bd_address -offset 0x00000000FF020000 -range 64K -target_address_space [get_bd_addr_spaces cips/CPM_PCIE_NOC_1] [get_bd_addr_segs cips/NOC_PMC_AXI_0/pspmc_0_psv_i2c_0]
assign_bd_address -offset 0x00000000FF030000 -range 64K -target_address_space [get_bd_addr_spaces cips/CPM_PCIE_NOC_1] [get_bd_addr_segs cips/NOC_PMC_AXI_0/pspmc_0_psv_i2c_1]
assign_bd_address -offset 0x00000000FF080000 -range 128K -target_address_space [get_bd_addr_spaces cips/CPM_PCIE_NOC_1] [get_bd_addr_segs cips/NOC_PMC_AXI_0/pspmc_0_psv_lpd_iou_slcr_0]
assign_bd_address -offset 0x00000000FF0A0000 -range 64K -target_address_space [get_bd_addr_spaces cips/CPM_PCIE_NOC_1] [get_bd_addr_segs cips/NOC_PMC_AXI_0/pspmc_0_psv_lpd_iou_secure_slcr_0]
assign_bd_address -offset 0x00000000FF0B0000 -range 64K -target_address_space [get_bd_addr_spaces cips/CPM_PCIE_NOC_1] [get_bd_addr_segs cips/NOC_PMC_AXI_0/pspmc_0_psv_gpio_2]
assign_bd_address -offset 0x00000000FF0E0000 -range 64K -target_address_space [get_bd_addr_spaces cips/CPM_PCIE_NOC_1] [get_bd_addr_segs cips/NOC_PMC_AXI_0/pspmc_0_psv_ttc_0]
assign_bd_address -offset 0x00000000FF0F0000 -range 64K -target_address_space [get_bd_addr_spaces cips/CPM_PCIE_NOC_1] [get_bd_addr_segs cips/NOC_PMC_AXI_0/pspmc_0_psv_ttc_1]
assign_bd_address -offset 0x00000000FF100000 -range 64K -target_address_space [get_bd_addr_spaces cips/CPM_PCIE_NOC_1] [get_bd_addr_segs cips/NOC_PMC_AXI_0/pspmc_0_psv_ttc_2]
assign_bd_address -offset 0x00000000FF110000 -range 64K -target_address_space [get_bd_addr_spaces cips/CPM_PCIE_NOC_1] [get_bd_addr_segs cips/NOC_PMC_AXI_0/pspmc_0_psv_ttc_3]
assign_bd_address -offset 0x00000000FF130000 -range 64K -target_address_space [get_bd_addr_spaces cips/CPM_PCIE_NOC_1] [get_bd_addr_segs cips/NOC_PMC_AXI_0/pspmc_0_psv_scntr_0]
assign_bd_address -offset 0x00000000FF140000 -range 64K -target_address_space [get_bd_addr_spaces cips/CPM_PCIE_NOC_1] [get_bd_addr_segs cips/NOC_PMC_AXI_0/pspmc_0_psv_scntrs_0]
assign_bd_address -offset 0x00000000FF310000 -range 64K -target_address_space [get_bd_addr_spaces cips/CPM_PCIE_NOC_1] [get_bd_addr_segs cips/NOC_PMC_AXI_0/pspmc_0_psv_ipi_psm]
assign_bd_address -offset 0x00000000FF320000 -range 64K -target_address_space [get_bd_addr_spaces cips/CPM_PCIE_NOC_1] [get_bd_addr_segs cips/NOC_PMC_AXI_0/pspmc_0_psv_ipi_pmc]
assign_bd_address -offset 0x00000000FF330000 -range 64K -target_address_space [get_bd_addr_spaces cips/CPM_PCIE_NOC_1] [get_bd_addr_segs cips/NOC_PMC_AXI_0/pspmc_0_psv_ipi_0]
assign_bd_address -offset 0x00000000FF340000 -range 64K -target_address_space [get_bd_addr_spaces cips/CPM_PCIE_NOC_1] [get_bd_addr_segs cips/NOC_PMC_AXI_0/pspmc_0_psv_ipi_1]
assign_bd_address -offset 0x00000000FF350000 -range 64K -target_address_space [get_bd_addr_spaces cips/CPM_PCIE_NOC_1] [get_bd_addr_segs cips/NOC_PMC_AXI_0/pspmc_0_psv_ipi_2]
assign_bd_address -offset 0x00000000FF360000 -range 64K -target_address_space [get_bd_addr_spaces cips/CPM_PCIE_NOC_1] [get_bd_addr_segs cips/NOC_PMC_AXI_0/pspmc_0_psv_ipi_3]
assign_bd_address -offset 0x00000000FF370000 -range 64K -target_address_space [get_bd_addr_spaces cips/CPM_PCIE_NOC_1] [get_bd_addr_segs cips/NOC_PMC_AXI_0/pspmc_0_psv_ipi_4]
assign_bd_address -offset 0x00000000FF380000 -range 64K -target_address_space [get_bd_addr_spaces cips/CPM_PCIE_NOC_1] [get_bd_addr_segs cips/NOC_PMC_AXI_0/pspmc_0_psv_ipi_5]
assign_bd_address -offset 0x00000000FF390000 -range 64K -target_address_space [get_bd_addr_spaces cips/CPM_PCIE_NOC_1] [get_bd_addr_segs cips/NOC_PMC_AXI_0/pspmc_0_psv_ipi_pmc_nobuf]
assign_bd_address -offset 0x00000000FF3A0000 -range 64K -target_address_space [get_bd_addr_spaces cips/CPM_PCIE_NOC_1] [get_bd_addr_segs cips/NOC_PMC_AXI_0/pspmc_0_psv_ipi_6]
assign_bd_address -offset 0x00000000FF410000 -range 1M -target_address_space [get_bd_addr_spaces cips/CPM_PCIE_NOC_1] [get_bd_addr_segs cips/NOC_PMC_AXI_0/pspmc_0_psv_lpd_slcr_0]
assign_bd_address -offset 0x00000000FF510000 -range 256K -target_address_space [get_bd_addr_spaces cips/CPM_PCIE_NOC_1] [get_bd_addr_segs cips/NOC_PMC_AXI_0/pspmc_0_psv_lpd_slcr_secure_0]
assign_bd_address -offset 0x00000000FF5E0000 -range 3M -target_address_space [get_bd_addr_spaces cips/CPM_PCIE_NOC_1] [get_bd_addr_segs cips/NOC_PMC_AXI_0/pspmc_0_psv_crl_0]
assign_bd_address -offset 0x00000000FF960000 -range 64K -target_address_space [get_bd_addr_spaces cips/CPM_PCIE_NOC_1] [get_bd_addr_segs cips/NOC_PMC_AXI_0/pspmc_0_psv_ocm_ctrl]
assign_bd_address -offset 0x00000000FF980000 -range 64K -target_address_space [get_bd_addr_spaces cips/CPM_PCIE_NOC_1] [get_bd_addr_segs cips/NOC_PMC_AXI_0/pspmc_0_psv_ocm_xmpu_0]
assign_bd_address -offset 0x00000000FF990000 -range 64K -target_address_space [get_bd_addr_spaces cips/CPM_PCIE_NOC_1] [get_bd_addr_segs cips/NOC_PMC_AXI_0/pspmc_0_psv_lpd_xppu_0]
assign_bd_address -offset 0x00000000FF9A0000 -range 64K -target_address_space [get_bd_addr_spaces cips/CPM_PCIE_NOC_1] [get_bd_addr_segs cips/NOC_PMC_AXI_0/pspmc_0_psv_rpu_0]
assign_bd_address -offset 0x00000000FF9B0000 -range 64K -target_address_space [get_bd_addr_spaces cips/CPM_PCIE_NOC_1] [get_bd_addr_segs cips/NOC_PMC_AXI_0/pspmc_0_psv_lpd_afi_0]
assign_bd_address -offset 0x00000000FFA80000 -range 64K -target_address_space [get_bd_addr_spaces cips/CPM_PCIE_NOC_1] [get_bd_addr_segs cips/NOC_PMC_AXI_0/pspmc_0_psv_adma_0]
assign_bd_address -offset 0x00000000FFA90000 -range 64K -target_address_space [get_bd_addr_spaces cips/CPM_PCIE_NOC_1] [get_bd_addr_segs cips/NOC_PMC_AXI_0/pspmc_0_psv_adma_1]
assign_bd_address -offset 0x00000000FFAA0000 -range 64K -target_address_space [get_bd_addr_spaces cips/CPM_PCIE_NOC_1] [get_bd_addr_segs cips/NOC_PMC_AXI_0/pspmc_0_psv_adma_2]
assign_bd_address -offset 0x00000000FFAB0000 -range 64K -target_address_space [get_bd_addr_spaces cips/CPM_PCIE_NOC_1] [get_bd_addr_segs cips/NOC_PMC_AXI_0/pspmc_0_psv_adma_3]
assign_bd_address -offset 0x00000000FFAC0000 -range 64K -target_address_space [get_bd_addr_spaces cips/CPM_PCIE_NOC_1] [get_bd_addr_segs cips/NOC_PMC_AXI_0/pspmc_0_psv_adma_4]
assign_bd_address -offset 0x00000000FFAD0000 -range 64K -target_address_space [get_bd_addr_spaces cips/CPM_PCIE_NOC_1] [get_bd_addr_segs cips/NOC_PMC_AXI_0/pspmc_0_psv_adma_5]
assign_bd_address -offset 0x00000000FFAE0000 -range 64K -target_address_space [get_bd_addr_spaces cips/CPM_PCIE_NOC_1] [get_bd_addr_segs cips/NOC_PMC_AXI_0/pspmc_0_psv_adma_6]
assign_bd_address -offset 0x00000000FFAF0000 -range 64K -target_address_space [get_bd_addr_spaces cips/CPM_PCIE_NOC_1] [get_bd_addr_segs cips/NOC_PMC_AXI_0/pspmc_0_psv_adma_7]
assign_bd_address -offset 0x00000000FFC90000 -range 60K -target_address_space [get_bd_addr_spaces cips/CPM_PCIE_NOC_1] [get_bd_addr_segs cips/NOC_PMC_AXI_0/pspmc_0_psv_psm_global_reg]
assign_bd_address -offset 0x00000000FFE00000 -range 256K -target_address_space [get_bd_addr_spaces cips/CPM_PCIE_NOC_1] [get_bd_addr_segs cips/NOC_PMC_AXI_0/pspmc_0_psv_r5_tcm_ram_global]
assign_bd_address -offset 0x00000000FFE90000 -range 64K -target_address_space [get_bd_addr_spaces cips/CPM_PCIE_NOC_1] [get_bd_addr_segs cips/NOC_PMC_AXI_0/pspmc_0_psv_r5_1_atcm_global]
assign_bd_address -offset 0x00000000FFEB0000 -range 64K -target_address_space [get_bd_addr_spaces cips/CPM_PCIE_NOC_1] [get_bd_addr_segs cips/NOC_PMC_AXI_0/pspmc_0_psv_r5_1_btcm_global]
assign_bd_address -offset 0x00000000FFFC0000 -range 256K -target_address_space [get_bd_addr_spaces cips/CPM_PCIE_NOC_1] [get_bd_addr_segs cips/NOC_PMC_AXI_0/pspmc_0_psv_ocm_ram_0]
assign_bd_address -offset 0x0000000100083000 -range 4K -target_address_space [get_bd_addr_spaces cips/CPM_PCIE_NOC_1] [get_bd_addr_segs cips/NOC_PMC_AXI_0/pspmc_0_psv_pmc_tmr_inject_0]
assign_bd_address -offset 0x0000000100200000 -range 256K -target_address_space [get_bd_addr_spaces cips/CPM_PCIE_NOC_1] [get_bd_addr_segs cips/NOC_PMC_AXI_0/pspmc_0_psv_pmc_ram_instr_cntlr]
assign_bd_address -offset 0x0000000100240000 -range 128K -target_address_space [get_bd_addr_spaces cips/CPM_PCIE_NOC_1] [get_bd_addr_segs cips/NOC_PMC_AXI_0/pspmc_0_psv_pmc_ram_data_cntlr]
assign_bd_address -offset 0x0000000100280000 -range 4K -target_address_space [get_bd_addr_spaces cips/CPM_PCIE_NOC_1] [get_bd_addr_segs cips/NOC_PMC_AXI_0/pspmc_0_psv_pmc_iomodule_0]
assign_bd_address -offset 0x0000000100283000 -range 4K -target_address_space [get_bd_addr_spaces cips/CPM_PCIE_NOC_1] [get_bd_addr_segs cips/NOC_PMC_AXI_0/pspmc_0_psv_pmc_tmr_manager_0]
assign_bd_address -offset 0x0000000100310000 -range 32K -target_address_space [get_bd_addr_spaces cips/CPM_PCIE_NOC_1] [get_bd_addr_segs cips/NOC_PMC_AXI_0/pspmc_0_psv_pmc_ppu1_mdm_0]
assign_bd_address -offset 0x0000000100800000 -range 64K -target_address_space [get_bd_addr_spaces cips/CPM_PCIE_NOC_1] [get_bd_addr_segs cips/NOC_PMC_AXI_0/pspmc_0_psv_coresight_0]
assign_bd_address -offset 0x0000000100980000 -range 64K -target_address_space [get_bd_addr_spaces cips/CPM_PCIE_NOC_1] [get_bd_addr_segs cips/NOC_PMC_AXI_0/pspmc_0_psv_coresight_lpd_atm]
assign_bd_address -offset 0x0000000100B70000 -range 64K -target_address_space [get_bd_addr_spaces cips/CPM_PCIE_NOC_1] [get_bd_addr_segs cips/NOC_PMC_AXI_0/pspmc_0_psv_coresight_fpd_stm]
assign_bd_address -offset 0x0000000100B80000 -range 64K -target_address_space [get_bd_addr_spaces cips/CPM_PCIE_NOC_1] [get_bd_addr_segs cips/NOC_PMC_AXI_0/pspmc_0_psv_coresight_fpd_atm]
assign_bd_address -offset 0x0000000100C20000 -range 64K -target_address_space [get_bd_addr_spaces cips/CPM_PCIE_NOC_1] [get_bd_addr_segs cips/NOC_PMC_AXI_0/pspmc_0_psv_coresight_apu_fun]
assign_bd_address -offset 0x0000000100C30000 -range 64K -target_address_space [get_bd_addr_spaces cips/CPM_PCIE_NOC_1] [get_bd_addr_segs cips/NOC_PMC_AXI_0/pspmc_0_psv_coresight_apu_etf]
assign_bd_address -offset 0x0000000100C60000 -range 64K -target_address_space [get_bd_addr_spaces cips/CPM_PCIE_NOC_1] [get_bd_addr_segs cips/NOC_PMC_AXI_0/pspmc_0_psv_coresight_apu_ela]
assign_bd_address -offset 0x0000000100CA0000 -range 64K -target_address_space [get_bd_addr_spaces cips/CPM_PCIE_NOC_1] [get_bd_addr_segs cips/NOC_PMC_AXI_0/pspmc_0_psv_coresight_apu_cti]
assign_bd_address -offset 0x0000000100D00000 -range 64K -target_address_space [get_bd_addr_spaces cips/CPM_PCIE_NOC_1] [get_bd_addr_segs cips/NOC_PMC_AXI_0/pspmc_0_psv_coresight_a720_dbg]
assign_bd_address -offset 0x0000000100D10000 -range 64K -target_address_space [get_bd_addr_spaces cips/CPM_PCIE_NOC_1] [get_bd_addr_segs cips/NOC_PMC_AXI_0/pspmc_0_psv_coresight_a720_cti]
assign_bd_address -offset 0x0000000100D20000 -range 64K -target_address_space [get_bd_addr_spaces cips/CPM_PCIE_NOC_1] [get_bd_addr_segs cips/NOC_PMC_AXI_0/pspmc_0_psv_coresight_a720_pmu]
assign_bd_address -offset 0x0000000100D30000 -range 64K -target_address_space [get_bd_addr_spaces cips/CPM_PCIE_NOC_1] [get_bd_addr_segs cips/NOC_PMC_AXI_0/pspmc_0_psv_coresight_a720_etm]
assign_bd_address -offset 0x0000000100D40000 -range 64K -target_address_space [get_bd_addr_spaces cips/CPM_PCIE_NOC_1] [get_bd_addr_segs cips/NOC_PMC_AXI_0/pspmc_0_psv_coresight_a721_dbg]
assign_bd_address -offset 0x0000000100D50000 -range 64K -target_address_space [get_bd_addr_spaces cips/CPM_PCIE_NOC_1] [get_bd_addr_segs cips/NOC_PMC_AXI_0/pspmc_0_psv_coresight_a721_cti]
assign_bd_address -offset 0x0000000100D60000 -range 64K -target_address_space [get_bd_addr_spaces cips/CPM_PCIE_NOC_1] [get_bd_addr_segs cips/NOC_PMC_AXI_0/pspmc_0_psv_coresight_a721_pmu]
assign_bd_address -offset 0x0000000100D70000 -range 64K -target_address_space [get_bd_addr_spaces cips/CPM_PCIE_NOC_1] [get_bd_addr_segs cips/NOC_PMC_AXI_0/pspmc_0_psv_coresight_a721_etm]
assign_bd_address -offset 0x0000000100F00000 -range 64K -target_address_space [get_bd_addr_spaces cips/CPM_PCIE_NOC_1] [get_bd_addr_segs cips/NOC_PMC_AXI_0/pspmc_0_psv_coresight_cpm_rom]
assign_bd_address -offset 0x0000000100F20000 -range 64K -target_address_space [get_bd_addr_spaces cips/CPM_PCIE_NOC_1] [get_bd_addr_segs cips/NOC_PMC_AXI_0/pspmc_0_psv_coresight_cpm_fun]
assign_bd_address -offset 0x0000000100F40000 -range 64K -target_address_space [get_bd_addr_spaces cips/CPM_PCIE_NOC_1] [get_bd_addr_segs cips/NOC_PMC_AXI_0/pspmc_0_psv_coresight_cpm_ela2a]
assign_bd_address -offset 0x0000000100F50000 -range 64K -target_address_space [get_bd_addr_spaces cips/CPM_PCIE_NOC_1] [get_bd_addr_segs cips/NOC_PMC_AXI_0/pspmc_0_psv_coresight_cpm_ela2b]
assign_bd_address -offset 0x0000000100F60000 -range 64K -target_address_space [get_bd_addr_spaces cips/CPM_PCIE_NOC_1] [get_bd_addr_segs cips/NOC_PMC_AXI_0/pspmc_0_psv_coresight_cpm_ela2c]
assign_bd_address -offset 0x0000000100F70000 -range 64K -target_address_space [get_bd_addr_spaces cips/CPM_PCIE_NOC_1] [get_bd_addr_segs cips/NOC_PMC_AXI_0/pspmc_0_psv_coresight_cpm_ela2d]
assign_bd_address -offset 0x0000000100F80000 -range 64K -target_address_space [get_bd_addr_spaces cips/CPM_PCIE_NOC_1] [get_bd_addr_segs cips/NOC_PMC_AXI_0/pspmc_0_psv_coresight_cpm_atm]
assign_bd_address -offset 0x0000000100FA0000 -range 64K -target_address_space [get_bd_addr_spaces cips/CPM_PCIE_NOC_1] [get_bd_addr_segs cips/NOC_PMC_AXI_0/pspmc_0_psv_coresight_cpm_cti2a]
assign_bd_address -offset 0x0000000100FD0000 -range 64K -target_address_space [get_bd_addr_spaces cips/CPM_PCIE_NOC_1] [get_bd_addr_segs cips/NOC_PMC_AXI_0/pspmc_0_psv_coresight_cpm_cti2d]
assign_bd_address -offset 0x0000000101000000 -range 64K -target_address_space [get_bd_addr_spaces cips/CPM_PCIE_NOC_1] [get_bd_addr_segs cips/NOC_PMC_AXI_0/pspmc_0_psv_pmc_i2c_0]
assign_bd_address -offset 0x0000000101010000 -range 64K -target_address_space [get_bd_addr_spaces cips/CPM_PCIE_NOC_1] [get_bd_addr_segs cips/NOC_PMC_AXI_0/pspmc_0_psv_pmc_ospi_0]
assign_bd_address -offset 0x0000000101020000 -range 64K -target_address_space [get_bd_addr_spaces cips/CPM_PCIE_NOC_1] [get_bd_addr_segs cips/NOC_PMC_AXI_0/pspmc_0_psv_pmc_gpio_0]
assign_bd_address -offset 0x0000000101110000 -range 320K -target_address_space [get_bd_addr_spaces cips/CPM_PCIE_NOC_1] [get_bd_addr_segs cips/NOC_PMC_AXI_0/pspmc_0_psv_pmc_global_0]
assign_bd_address -offset 0x00000001011C0000 -range 64K -target_address_space [get_bd_addr_spaces cips/CPM_PCIE_NOC_1] [get_bd_addr_segs cips/NOC_PMC_AXI_0/pspmc_0_psv_pmc_dma_0]
assign_bd_address -offset 0x00000001011D0000 -range 64K -target_address_space [get_bd_addr_spaces cips/CPM_PCIE_NOC_1] [get_bd_addr_segs cips/NOC_PMC_AXI_0/pspmc_0_psv_pmc_dma_1]
assign_bd_address -offset 0x00000001011E0000 -range 64K -target_address_space [get_bd_addr_spaces cips/CPM_PCIE_NOC_1] [get_bd_addr_segs cips/NOC_PMC_AXI_0/pspmc_0_psv_pmc_aes]
assign_bd_address -offset 0x00000001011F0000 -range 64K -target_address_space [get_bd_addr_spaces cips/CPM_PCIE_NOC_1] [get_bd_addr_segs cips/NOC_PMC_AXI_0/pspmc_0_psv_pmc_bbram_ctrl]
assign_bd_address -offset 0x0000000101200000 -range 64K -target_address_space [get_bd_addr_spaces cips/CPM_PCIE_NOC_1] [get_bd_addr_segs cips/NOC_PMC_AXI_0/pspmc_0_psv_pmc_rsa]
assign_bd_address -offset 0x0000000101210000 -range 64K -target_address_space [get_bd_addr_spaces cips/CPM_PCIE_NOC_1] [get_bd_addr_segs cips/NOC_PMC_AXI_0/pspmc_0_psv_pmc_sha]
assign_bd_address -offset 0x0000000101220000 -range 64K -target_address_space [get_bd_addr_spaces cips/CPM_PCIE_NOC_1] [get_bd_addr_segs cips/NOC_PMC_AXI_0/pspmc_0_psv_pmc_slave_boot]
assign_bd_address -offset 0x0000000101230000 -range 64K -target_address_space [get_bd_addr_spaces cips/CPM_PCIE_NOC_1] [get_bd_addr_segs cips/NOC_PMC_AXI_0/pspmc_0_psv_pmc_trng]
assign_bd_address -offset 0x0000000101240000 -range 64K -target_address_space [get_bd_addr_spaces cips/CPM_PCIE_NOC_1] [get_bd_addr_segs cips/NOC_PMC_AXI_0/pspmc_0_psv_pmc_efuse_ctrl]
assign_bd_address -offset 0x0000000101250000 -range 64K -target_address_space [get_bd_addr_spaces cips/CPM_PCIE_NOC_1] [get_bd_addr_segs cips/NOC_PMC_AXI_0/pspmc_0_psv_pmc_efuse_cache]
assign_bd_address -offset 0x0000000101260000 -range 64K -target_address_space [get_bd_addr_spaces cips/CPM_PCIE_NOC_1] [get_bd_addr_segs cips/NOC_PMC_AXI_0/pspmc_0_psv_crp_0]
assign_bd_address -offset 0x0000000101270000 -range 192K -target_address_space [get_bd_addr_spaces cips/CPM_PCIE_NOC_1] [get_bd_addr_segs cips/NOC_PMC_AXI_0/pspmc_0_psv_pmc_sysmon_0]
assign_bd_address -offset 0x00000001012A0000 -range 64K -target_address_space [get_bd_addr_spaces cips/CPM_PCIE_NOC_1] [get_bd_addr_segs cips/NOC_PMC_AXI_0/pspmc_0_psv_pmc_rtc_0]
assign_bd_address -offset 0x00000001012B0000 -range 64K -target_address_space [get_bd_addr_spaces cips/CPM_PCIE_NOC_1] [get_bd_addr_segs cips/NOC_PMC_AXI_0/pspmc_0_psv_pmc_cfu_apb_0]
assign_bd_address -offset 0x00000001012D0000 -range 4K -target_address_space [get_bd_addr_spaces cips/CPM_PCIE_NOC_1] [get_bd_addr_segs cips/NOC_PMC_AXI_0/pspmc_0_psv_pmc_cfi_cframe_0]
assign_bd_address -offset 0x00000001012F0000 -range 64K -target_address_space [get_bd_addr_spaces cips/CPM_PCIE_NOC_1] [get_bd_addr_segs cips/NOC_PMC_AXI_0/pspmc_0_psv_pmc_xmpu_0]
assign_bd_address -offset 0x0000000101300000 -range 64K -target_address_space [get_bd_addr_spaces cips/CPM_PCIE_NOC_1] [get_bd_addr_segs cips/NOC_PMC_AXI_0/pspmc_0_psv_pmc_xppu_npi_0]
